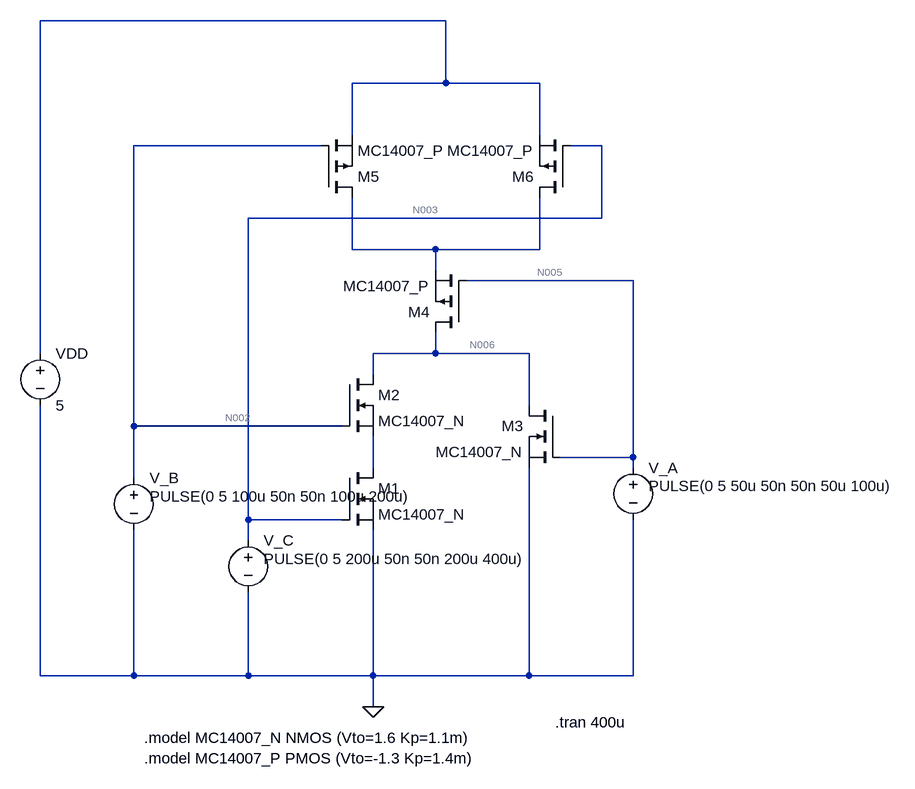
[diagram p0: schematic 14.asc]
14.asc, the LTspice schematic file:
Version 4.1
SHEET 1 1196 680
WIRE 480 -720 -144 -720
WIRE 480 -624 480 -720
WIRE 480 -624 336 -624
WIRE 624 -624 480 -624
WIRE 336 -544 336 -624
WIRE 624 -544 624 -624
WIRE 288 -528 0 -528
WIRE 720 -528 672 -528
WIRE 720 -416 720 -528
WIRE 720 -416 176 -416
WIRE 336 -368 336 -448
WIRE 464 -368 336 -368
WIRE 624 -368 624 -448
WIRE 624 -368 464 -368
WIRE 464 -336 464 -368
WIRE 768 -320 512 -320
WIRE -144 -208 -144 -720
WIRE 464 -208 464 -240
WIRE 464 -208 368 -208
WIRE 608 -208 464 -208
WIRE 368 -176 368 -208
WIRE 608 -128 608 -208
WIRE 0 -96 0 -528
WIRE 320 -96 0 -96
WIRE 768 -48 768 -320
WIRE 768 -48 656 -48
WIRE 368 -32 368 -80
WIRE 768 -32 768 -48
WIRE 0 -16 0 -96
WIRE 176 48 176 -416
WIRE 320 48 176 48
WIRE 176 80 176 48
WIRE -144 288 -144 -128
WIRE 0 288 0 64
WIRE 0 288 -144 288
WIRE 176 288 176 160
WIRE 176 288 0 288
WIRE 368 288 368 64
WIRE 368 288 176 288
WIRE 608 288 608 -32
WIRE 608 288 368 288
WIRE 768 288 768 48
WIRE 768 288 608 288
WIRE 368 336 368 288
FLAG 368 336 0
SYMBOL voltage -144 -224 R0
SYMATTR InstName VDD
SYMATTR Value 5
SYMBOL voltage 0 -32 R0
WINDOW 3 24 44 Left 2
WINDOW 123 0 0 Left 0
WINDOW 39 0 0 Left 0
SYMATTR Value PULSE(0 5 100u 50n 50n 100u 200u)
SYMATTR InstName V_B
SYMBOL voltage 176 64 R0
WINDOW 3 24 44 Left 2
WINDOW 123 0 0 Left 0
WINDOW 39 0 0 Left 0
SYMATTR Value PULSE(0 5 200u 50n 50n 200u 400u)
SYMATTR InstName V_C
SYMBOL voltage 768 -48 R0
WINDOW 3 24 44 Left 2
WINDOW 123 0 0 Left 0
WINDOW 39 0 0 Left 0
SYMATTR Value PULSE(0 5 50u 50n 50n 50u 100u)
SYMATTR InstName V_A
SYMBOL nmos 320 -32 R0
SYMATTR InstName M1
SYMATTR Value MC14007_N
SYMBOL nmos 320 -176 R0
SYMATTR InstName M2
SYMATTR Value MC14007_N
SYMBOL nmos 656 -128 M0
SYMATTR InstName M3
SYMATTR Value MC14007_N
SYMBOL pmos 288 -448 M180
SYMATTR InstName M5
SYMATTR Value MC14007_P
SYMBOL pmos 672 -448 R180
SYMATTR InstName M6
SYMATTR Value MC14007_P
SYMBOL pmos 512 -240 R180
SYMATTR InstName M4
SYMATTR Value MC14007_P
TEXT 16 384 Left 2 !.model MC14007_N NMOS (Vto=1.6 Kp=1.1m)\n.model MC14007_P PMOS (Vto=-1.3 Kp=1.4m)
TEXT 648 360 Left 2 !.tran 400u

The netlist it stands for:
* 14.asc
VDD N001 0 5
V_B N002 0 PULSE(0 5 100u 50n 50n 100u 200u)
V_C N003 0 PULSE(0 5 200u 50n 50n 200u 400u)
V_A N005 0 PULSE(0 5 50u 50n 50n 50u 100u)
M1 N007 N003 0 0 MC14007_N
M2 N006 N002 N007 N007 MC14007_N
M3 N006 N005 0 0 MC14007_N
M5 N004 N002 N001 N001 MC14007_P
M6 N004 N003 N001 N001 MC14007_P
M4 N006 N005 N004 N004 MC14007_P
.model NMOS NMOS
.model PMOS PMOS
.lib standard.mos
.model MC14007_N NMOS (Vto=1.6 Kp=1.1m)
.model MC14007_P PMOS (Vto=-1.3 Kp=1.4m)
.tran 400u
.backanno
.end

* Results of the author's LTspice run, read from the files saved beside the schematic
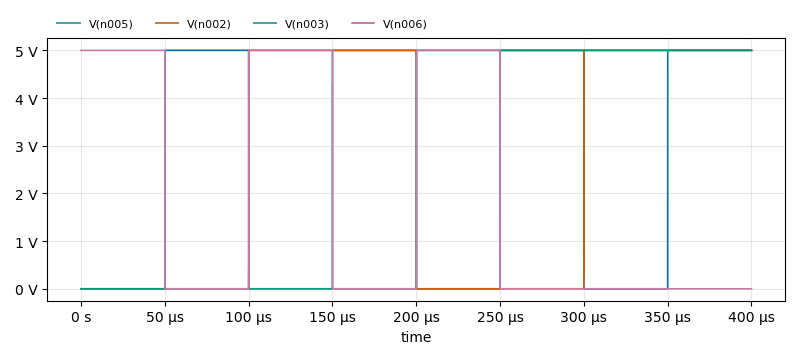
[diagram p1: Transient Analysis of 14.asc, plotted from the saved traces]
* Transient Analysis, 1 run:
*   V(n005): min 0 V, max 5 V, average 2.502 V, rms 3.536 V, last 5 V
*   V(n002): min 0 V, max 5 V, average 2.5 V, rms 3.536 V, last 5 V
*   V(n003): min 0 V, max 5 V, average 2.5 V, rms 3.535 V, last 5 V
*   V(n006): min 0 V, max 5 V, average 1.874 V, rms 3.061 V, last 0 V